# EAGLE design main (EAGLE 9.3.0)
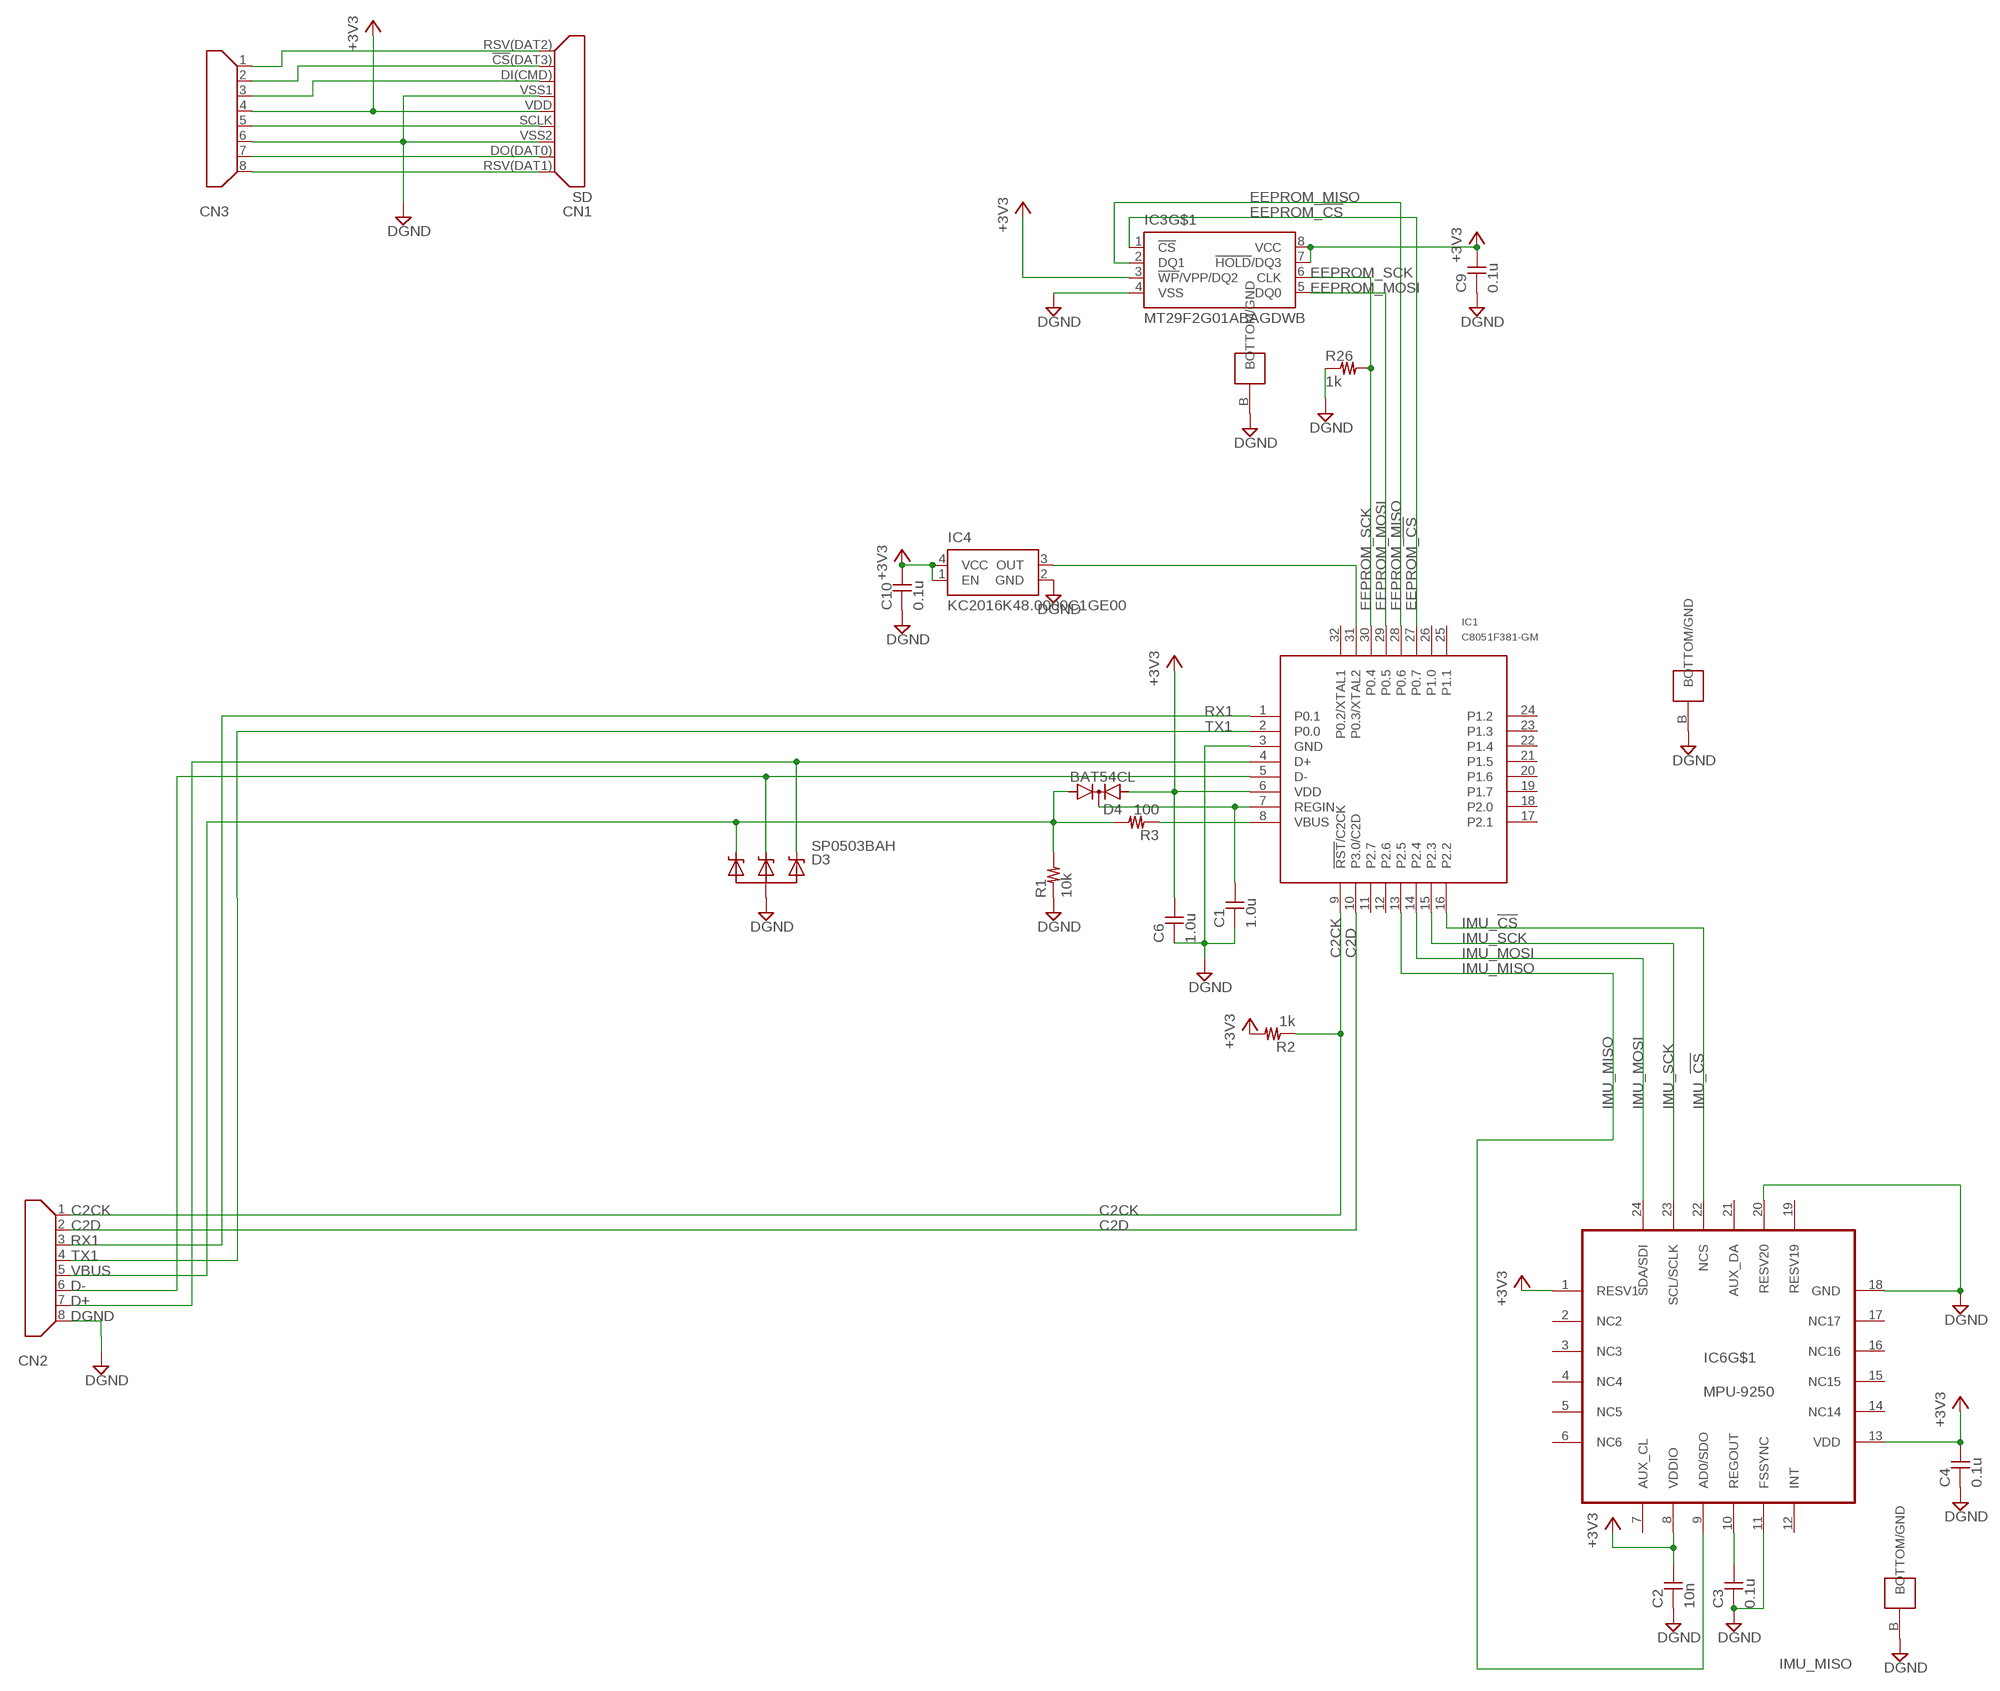
[diagram p0: schematic, sheet 1]

## Parts
C1  1.0u  C-1005  [1005]
C2  10n  C-1005  [1005]
C3  0.1u  C-1005  [1005]
C4  0.1u  C-1005  [1005]
C6  1.0u  C-1005  [1005]
C9  0.1u  C-1005  [1005]
C10  0.1u  C-1005  [1005]
CN1  SD  [SD_V3]
CN2  MICROSD  [BLOCK_SD_CONNECTOR]
CN3  MICROSD  [BLOCK_SD_CONNECTOR]
D3  SP0503BAH  [SOT143]
D4  BAT54CL  HSMS-2854  [SOT23]
IC1  C8051F381-GM  [QFN32]
IC3  MT29F2G01ABAGDWB  N25Q512A  [V-PDFN-8]
IC4  KC2016K48.0000C1GE00  KC2016K  [KC2016K]
IC6  MPU-9250  [QFN-24]
R1  10k  R-1005  [1005]
R2  1k  R-1005  [1005]
R3  100  R-1005  [1005]
R26  1k  R-1005  [1005]

## Nets
+3V3 [power]: C2.P$2 C4.P$2 C6.P$2 C9.P$2 C10.P$2 CN1.VDD CN3.4 D4.2(A2) IC1.6(VDD) IC3.3(!WP!/VPP/DQ2) IC3.7(!HOLD!/DQ3) IC3.8(VCC) IC4.1(EN) IC4.4(VCC) IC6.1(RESV1) IC6.8(VDDIO) IC6.13(VDD) R2.P$2
C2CK: CN2.1 IC1.9(!RST!/C2CK) R2.P$1
C2D: CN2.2 IC1.10(P3.0/C2D)
D+: CN2.7 D3.2 IC1.4(D+)
D-: CN2.6 D3.3 IC1.5(D-)
DGND [power]: C1.P$1 C2.P$1 C3.P$1 C4.P$1 C6.P$1 C9.P$1 C10.P$1 CN1.VSS1 CN1.VSS2 CN2.8 CN3.6 D3.1 IC1.3(GND) IC1.B(BOTTOM/GND) IC3.4(VSS) IC3.B(BOTTOM/GND) IC4.2(GND) IC6.11(FSSYNC) IC6.18(GND) IC6.20(RESV20) IC6.B(BOTTOM/GND) R1.P$1 R26.P$1
EEPROM_!CS: IC1.27(P0.7) IC3.1(!CS)
EEPROM_MISO: IC1.28(P0.6) IC3.2(DQ1)
EEPROM_MOSI: IC1.29(P0.5) IC3.5(DQ0)
EEPROM_SCK: IC1.30(P0.4) IC3.6(CLK) R26.P$2
IMU_!CS: IC1.16(P2.2) IC6.22(NCS)
IMU_MISO: IC1.13(P2.5) IC6.9(AD0/SDO)
IMU_MOSI: IC1.14(P2.4) IC6.24(SDA/SDI)
IMU_SCK: IC1.15(P2.3) IC6.23(SCL/SCLK)
N$1 [power]: C1.P$2 D4.3(C) IC1.7(REGIN)
N$2: CN1.RSV(DAT1) CN3.8
N$3: CN1.DO(DAT0) CN3.7
N$4: IC1.8(VBUS) R3.P$1
N$6: CN1.SCLK CN3.5
N$10: CN1.DI(CMD) CN3.3
N$11: IC1.31(P0.3/XTAL2) IC4.3(OUT)
N$12: CN1.!CS!(DAT3) CN3.2
N$13: C3.P$2 IC6.10(REGOUT)
N$14: CN1.RSV(DAT2) CN3.1
RX1: CN2.3 IC1.1(P0.1)
TX1: CN2.4 IC1.2(P0.0)
VBUS [power]: CN2.5 D3.4 D4.1(A1) R1.P$2 R3.P$2
Unconnected: IC1.11(P2.7) IC1.12(P2.6) IC1.17(P2.1) IC1.18(P2.0) IC1.19(P1.7) IC1.20(P1.6) IC1.21(P1.5) IC1.22(P1.4) IC1.23(P1.3) IC1.24(P1.2) IC1.25(P1.1) IC1.26(P1.0) IC1.32(P0.2/XTAL1) IC6.2(NC2) IC6.3(NC3) IC6.4(NC4) IC6.5(NC5) IC6.6(NC6) IC6.7(AUX_CL) IC6.12(INT) IC6.14(NC14) IC6.15(NC15) IC6.16(NC16) IC6.17(NC17) IC6.19(RESV19) IC6.21(AUX_DA)

## Library data of the parts
C1-C4 C6 C9 C10 = reg,cap:C-
CN1 = connector:SD
CN2 CN3 = connector:MICROSD
D3 = diode:SP0503BAH
D4 = avago:HSMS-2854: Surface Mount Microwave Schottky Detector Diodes Source: Data sheet <http://www.farnell.com/datasheets/461166.pdf>
IC1 = C8051F34x:C8051F381-GM
IC3 = EEPROM:N25Q512A
IC4 = Oscillator:KC2016K
IC6 = GYRO:MPU-9250
R1-R3 R26 = reg,cap:R-

## Net classes
0 signal: width 0.152 mm
1 power: width 0.203 mm

## Board
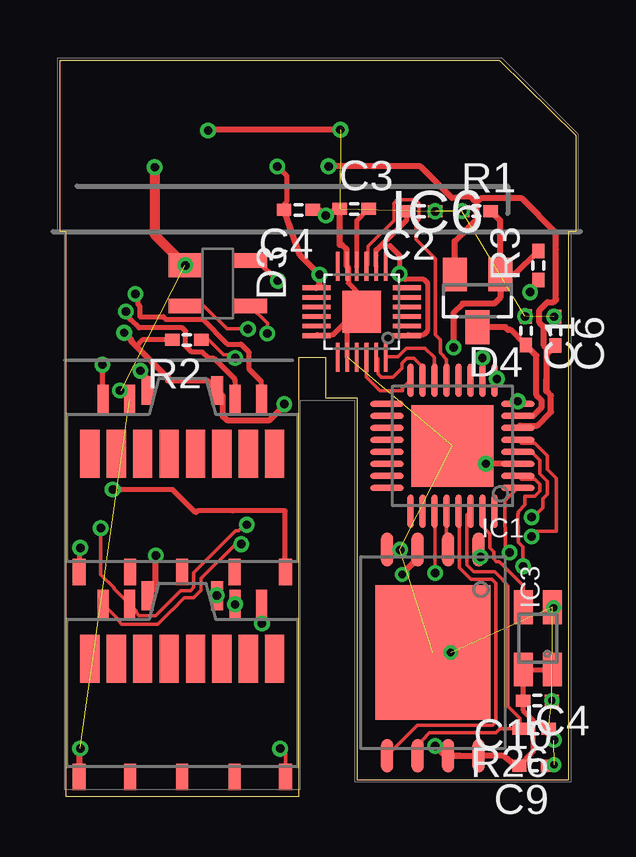
[diagram p1: board, top side]
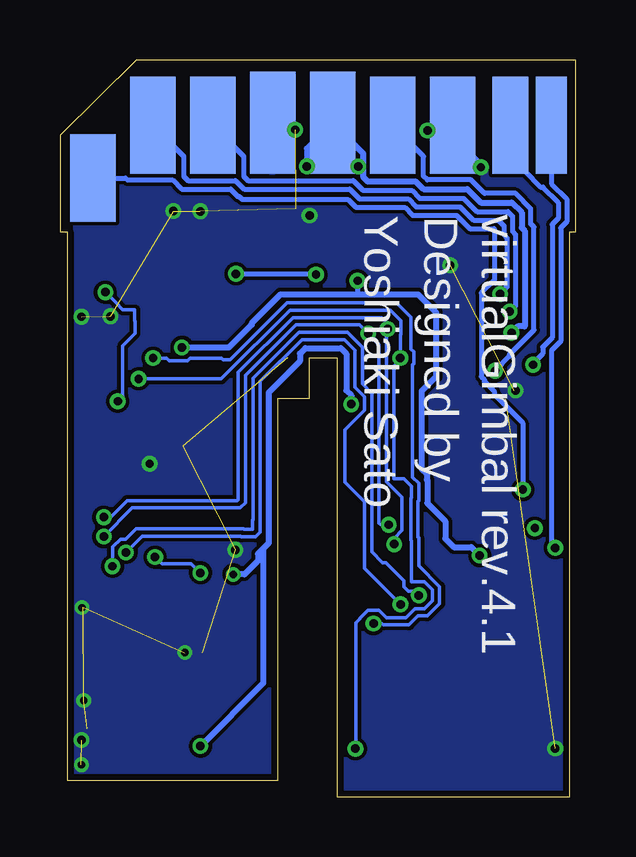
[diagram p2: board, bottom side, seen from below]

Size 21.5 x 30.7 mm. Coordinates in mm from the lower left corner, seen from the top.
Outline: 0.25,0 0.25,23.55 0,23.55 0,30.7 18.32,30.7 21.5,27.57 21.5,23.55 21.2,23.55 21.2,0.7 12.4,0.7 12.4,16.6 11.1,16.6 11.1,18.3 9.95,18.3 9.95,0 0.25,0
Copper layers (1*16): Top 0.035mm / dielectric 1.5mm / Bottom 0.035mm
Design rules "SeeedStudio_2layer_DRU_no_angle_20140221": minimum track width 6mil, minimum drill 12mil, track to track 6mil, track to pad 6mil, pad to pad 6mil, via to via 6mil, smd to smd 0mil, copper to edge 10mil, drill to drill 10mil, minimum pad ring 10mil, minimum via ring 6mil, stop-mask expansion 2mil, vias tented up to drill 100mil, thermal gap 10mil

### Footprints (pad centres in the part's own frame; a part is rotated, then mirrored left to right if it is on the bottom)
1005 = smd 0.6 x 0.5: P$1 -0.6,0; P$2 0.6,0
SD_V3 = smd 1.9 x 4.05: !CS!(DAT3) 2.5,2.2; DI(CMD) 5,2.2; SCLK 12.5,2.2; VSS2 15,2.2 | smd 1.5 x 4.05: DO(DAT0) 17.42,2.2 | smd 1.3 x 4.05: RSV(DAT1) 19.12,2.2 | smd 1.9 x 3.65: RSV(DAT2) 0,0 | smd 1.9 x 4.25: VDD 10,2.3; VSS1 7.5,2.3
BLOCK_SD_CONNECTOR = smd 0.55 x 1.1: 1 4.3,-0.43; 8 -4.3,-0.43 | smd 0.45 x 1.2: 2 3.3,6.77; 3 2.2,6.77; 6 -2.2,6.77; 7 -3.3,6.77 | smd 0.5 x 1.2: 4 1.45,7.13; 5 -1.45,7.13 | smd 0.5 x 1.1: 9 -2.18,-0.43; 10 0,-0.43; 11 2.18,-0.43 | smd 0.8 x 2: 12 -3.85,4.5; 13 -2.75,4.5; 14 -1.65,4.5; 15 -0.55,4.5; 16 0.55,4.5; 17 1.65,4.5; 18 2.75,4.5; 19 3.85,4.5
SOT143 = smd 1 x 1.4: 1 -0.75,-1.35 | smd 0.6 x 1.4: 2 0.95,-1.35; 3 0.95,1.35; 4 -0.95,1.35
SOT23 = smd 1 x 1.4: 1 -0.95,-1.1; 2 0.95,-1.1; 3 0,1.1
QFN32 = smd 1.4 x 0.25: 1 -2.725,1.75; 2 -2.725,1.25; 3 -2.725,0.75; 4 -2.725,0.25; 5 -2.725,-0.25; 6 -2.725,-0.75; 7 -2.725,-1.25; 8 -2.725,-1.75; 17 2.725,-1.75; 18 2.725,-1.25; 19 2.725,-0.75; 20 2.725,-0.25; 21 2.725,0.25; 22 2.725,0.75; 23 2.725,1.25; 24 2.725,1.75 | smd 0.25 x 1.4: 9 -1.75,-2.725; 10 -1.25,-2.725; 11 -0.75,-2.725; 12 -0.25,-2.725; 13 0.25,-2.725; 14 0.75,-2.725; 15 1.25,-2.725; 16 1.75,-2.725; 25 1.75,2.725; 26 1.25,2.725; 27 0.75,2.725; 28 0.25,2.725; 29 -0.25,2.725; 30 -0.75,2.725; 31 -1.25,2.725; 32 -1.75,2.725 | smd 3.4 x 3.4: B 0,0
V-PDFN-8 = smd 1.4 x 0.5: 1 -4.3,1.905; 2 -4.3,0.635; 3 -4.3,-0.635; 4 -4.3,-1.905; 5 4.3,-1.905; 6 4.3,-0.635; 7 4.3,0.635; 8 4.3,1.905 | smd 5.6 x 4.8: B 0,0
KC2016K = smd 1.4 x 0.8: 1 -1.3,-0.6; 2 1.3,-0.6; 3 1.3,0.6; 4 -1.3,0.6
QFN-24 = smd 1.22 x 0.2: 1 -1.89,1; 2 -1.89,0.6; 3 -1.89,0.2; 4 -1.89,-0.2; 5 -1.89,-0.6; 6 -1.89,-1; 13 1.89,-1; 14 1.89,-0.6; 15 1.89,-0.2; 16 1.89,0.2; 17 1.89,0.6; 18 1.89,1 | smd 0.2 x 1.22: 7 -1,-1.89; 8 -0.6,-1.89; 9 -0.2,-1.89; 10 0.2,-1.89; 11 0.6,-1.89; 12 1,-1.89; 19 1,1.89; 20 0.6,1.89; 21 0.2,1.89; 22 -0.2,1.89; 23 -0.6,1.89; 24 -1,1.89 | smd 1.59 x 1.75: B 0,0

### Placement (x,y rotation side)
C1  19.43,19.42 270 top
C2  15.05,24.39 180 top
C3  12.27,24.5 0 top
C4  9.94,24.46 180 top
C6  20.66,19.4 270 top
C9  19.75,1.3 180 top
C10  19.91,4.01 180 top
CN1  20.13,25.78 0 bottom
CN2  5.1,1.25 0 top
CN3  5.1,9.8 0 top
D3  6.58,21.39 270 top
D4  17.41,20.66 180 top
IC1  16.36,14.62 180 top
IC3  15.55,6 270 top
IC4  19.93,6.6 90 top
IC6  12.58,20.21 180 top
R1  17.36,24.41 0 top
R2  5.29,19.04 180 top
R3  19.95,22.14 90 top
R26  19.77,2.84 180 top

### Tracks (layer width: path | path; a pad name or v marks a point on that pad's centre or on a via)
+3V3  (via drill 0.3, 0.35)
  Top 0.203: IC3.3 14.97,10.36 | 19.72,1.87 19.72,3.2 19.31,3.61 C10.P$2 19.31,5.29 IC4.4 IC4.1 | 19.72,1.87 19.09,1.24 | C9.P$2 19.72,1.87 | IC6.8 13.18,22.8 | C4.P$2 9.34,24.69 9.46,24.8 9.46,25.86 v9.06,26.26 | IC6.1 14.52,19.26 15.17,19.26 15.33,19.42 15.33,21.4 15.17,21.56 14.39,21.56 v14.16,21.79 14.16,22.3 14.16,22.57 13.77,22.96 13.39,22.96 13.22,22.8 | 13.18,22.55 13.18,22.8 | 13.18,22.8 13.22,22.8 | 13.22,22.8 14.45,24.03 C2.P$2 | 16.35,24.95 16.49,24.95 16.52,24.99 17.13,24.99 17.26,24.86 17.37,24.74 | R2.P$2 3.44,19.04 3.18,18.78
  Top 0.254: IC3.7 16.7,1.71 | 16.7,1.71 IC3.8 18.49,1.71 19.09,1.24 | C4.P$2 10.02,22.57 v10.82,21.76 10.82,21.35 IC6.13 | v2.68,19.34 2.99,19.02 2.99,18.97 3.18,18.78 4.4,17.56 4.45,17.56 4.49,17.52 4.49,17.35 6.13,17.35 CN3.4 6.8,16.68 6.8,15.85 6.96,15.69 8.74,15.69 9.2,16.15 9.46,16.15 9.46,16.25 v9.35,16.36 | 19.32,4.01 C10.P$2 | 16.7,1.71 16.05,1.71 v15.64,2.11 | IC3.3 14.91,9.91 v14.27,9.27 | 20.29,16.89 20.48,16.71 20.48,16.04 19.9,15.47 19.18,15.47 IC1.6 | 20.29,16.89 20.28,16.91 20.28,17.39 | C6.P$2 20.29,18.43 | 20.29,16.89 20.29,18.3 | 20.29,18.3 20.29,18.43 | D4.2 16.46,23.16 17.37,24.07 17.37,24.74 | v11.2,26.27 15.03,26.27 16.35,24.95 | 17.26,24.86 17.47,24.86 17.55,24.93 19.26,24.93 20.68,23.5 20.68,22.8 20.68,20.76 20.68,20.7 20.59,20.61 20.33,20.61 20,20.28 20,19.75 20.14,19.61 20.14,19.59 20.18,19.54 20.18,18.8 20.29,18.69 20.29,18.3 | 20.29,18.3 | 20.29,18.3 20.29,18.43
  Bottom 0.203: v9.06,26.26 8.87,26.26 8.86,26.25 | v14.16,21.79 10.85,21.79 v10.82,21.76
  Bottom 0.254: v14.27,9.27 13.8,9.27 13.24,9.83 13.24,10.12 13.02,10.35 | v2.68,19.34 2.41,19.6 2.12,19.6 2.12,23.59 2.25,23.71 2.25,24.35 2.66,24.76 3.95,24.76 4.51,25.32 6.34,25.32 6.67,25.65 8.67,25.65 8.86,25.84 8.86,26.25 8.86,26.81 CN1.VDD 11.2,27.01 v11.2,26.27 | v15.64,2.11 13.02,4.74 13.02,10.35 | 13.02,10.35 12.8,10.57 12.8,16.84 11.5,18.14 11.5,18.46 11.26,18.7 9.79,18.7 9.55,18.46 9.55,16.93 9.35,16.73 v9.35,16.36
C2CK  (via drill 0.35)
  Top 0.152: IC1.9 18.15,17.35 v18.22,17.41 | v9.18,2 9.4,1.79 CN2.1 | R2.P$1 6.2,19.04 6.82,18.42 7.17,18.42 v7.31,18.28
  Bottom 0.152: v18.22,17.41 14.77,17.41 11.92,20.27 7.73,20.27 7.29,19.83 7.29,19.27 7.31,19.24 v7.31,18.28 7.31,18.22 7.58,17.95 7.58,13.26 7.17,13.26 6.84,12.93 6.84,12.47 6.87,12.44 6.87,10.69 6.84,10.67 6.84,8.95 6.3,8.95 5.98,8.63 5.98,8.17 6.3,7.84 6.69,7.84 7.07,7.46 7.89,7.46 8.19,7.77 8.65,7.77 8.98,7.44 8.98,7.42 9.15,7.25 9.15,2.03 v9.18,2
C2D  (via drill 0.35)
  Top 0.152: IC1.10 v17.61,18.28 | v8.42,7.21 8.42,8 CN2.2
  Bottom 0.152: v8.42,7.21 8.07,7.21 8.01,7.16 6.94,7.16 6.57,7.54 6.18,7.54 5.67,8.04 5.67,8.75 6.54,9.62 6.54,10.79 6.57,10.82 6.57,12.31 6.53,12.34 6.53,13.06 6.79,13.32 6.79,18 6.75,18.05 6.75,18.54 6.87,18.66 6.87,19.98 7.46,20.58 12.04,20.58 14.41,18.21 14.69,18.21 14.77,18.28 16.07,18.28 16.18,18.17 16.95,18.17 17.06,18.28 v17.61,18.28
D+  (via drill 0.35)
  Top 0.152: v19.67,11.65 19.75,11.65 20.13,12.04 20.13,12.41 20.32,12.6 20.32,13.15 20.02,13.45 20.02,14.02 19.7,14.35 19.12,14.35 IC1.4 | CN2.7 2.45,7.37 2.45,7.33 2.58,7.19 4.07,7.19 4.67,7.8 4.7,7.8 5.19,8.29 5.57,8.29 5.88,8.6 5.88,9.1 7.31,10.53 v7.56,10.53 | v7.84,19.5 6.97,19.5 6.02,20.45 D3.2
  Bottom 0.152: v19.67,11.65 19.39,11.65 18.7,12.34 14.11,12.34 14.07,12.38 14.07,17.69 11.79,19.97 8.09,19.97 7.87,19.75 7.88,19.73 7.88,19.3 | v7.56,10.53 7.56,10.78 7.24,11.1 7.24,12.49 7.88,13.13 7.88,19.3 | 7.88,19.3 | 7.88,19.3 7.84,19.34 v7.84,19.5
D-  (via drill 0.35)
  Top 0.152: IC1.5 19.24,14.73 19.81,14.73 20.32,14.22 20.32,13.64 20.7,13.27 20.7,11.07 20.2,11.07 19.89,11.07 v19.67,10.85 | v7.79,11.33 7.7,11.33 7.45,11.08 7.33,11.08 7.12,10.88 5.58,9.33 5.58,8.73 5.45,8.59 5.04,8.59 4,7.55 3.31,7.55 3.17,7.68 3.17,7.75 CN2.6 2.25,8.67 2.25,8.71 1.71,9.26 1.71,10.73 1.7,10.74 v1.7,11.19 | D3.3 8.65,19.72 v8.65,19.3
  Bottom 0.152: v19.67,10.85 18.48,12.04 13.98,12.04 13.76,12.25 13.76,17.56 11.66,19.66 9.01,19.66 v8.65,19.3 8.19,18.84 8.19,18.3 | 8.19,18.3 8.19,17.8 8.19,11.4 8.12,11.33 v7.79,11.33 | 8.19,18.3
DGND  (via drill 0.3, 0.35)  (14 unrouted)
  Top 0.203: IC6.20 11.98,19.61 12.43,20.07 | 12.43,20.07 IC6.B 12.58,20.85 12.02,21.4 12.02,22.06 IC6.11 | IC6.18 10.74,19.26 11.39,19.26 12.2,20.07 12.43,20.07 | C4.P$1 10.85,24.46 v11.09,24.22 11.17,24.22 11.45,24.5 C3.P$1 | C1.P$1 v19.39,20.02
  Top 0.254: C3.P$1 11.67,22.99 11.78,22.99 11.96,22.81 11.96,22.12 IC6.11 | IC1.3 v17.76,13.88 17.01,14.62 | v0.85,2.02 0.8,1.97 CN2.8 | CN3.6 2.55,16.93 v2.51,16.93 | v11.69,27.8 6.21,27.8 v6.17,27.76 | 20.56,1.29 C9.P$1 20.57,1.3 v20.61,1.33 | R26.P$1 20.37,2.59 v20.6,2.36 | IC3.4 14.17,10.31 v14.18,10.29 | IC3.B v16.29,6.01 | C6.P$1 v20.6,20 | IC4.2 20.56,7.9 v20.58,7.88
  Top 0.305: IC1.B 17.01,14.62
  Top 0.406: v3.95,26.23 3.95,23.42 D3.1
  Bottom 0.254: CN1.VSS2 5.24,28.09 5.57,27.76 v6.17,27.76 | CN1.VSS1 12.34,27.8 v11.69,27.8
  Bottom 0.406: CN1.VSS2 5.13,27.41 v3.95,26.23
  other vias: 20.51,4.01 15.65,24.39 16.77,24.41 5.23,22.14
  pour Bottom: -0.3,-0.7 22.7,-0.7 22.7,26.3 -0.3,26.3
EEPROM_!CS  (via drill 0.35)
  Top 0.152: v17.54,9.99 17.54,10.23 IC3.1 | IC1.27 15.61,11.57 15.64,11.54 v15.64,9.33
  Bottom 0.152: v15.64,9.33 16.02,9.71 17.25,9.71 v17.54,9.99
EEPROM_MISO
  Top 0.152: IC1.28 16.11,10.38 IC3.2
EEPROM_MOSI
  Top 0.152: IC3.5 14.92,2.98 18.04,2.98 18.18,3.11 18.18,8.9 18.01,9.07 17.13,9.07 16.66,9.54 16.66,11.9 IC1.29
EEPROM_SCK
  Top 0.152: 18.68,8.57 18.68,3.77 19.17,3.28 R26.P$2 18.34,2.84 18.17,2.67 15.88,2.67 15.41,2.67 15.09,2.34 15.09,1.88 IC3.6 | 18.68,8.57 18.68,8.8 | 18.68,8.57 18.68,8.8 | 18.68,8.8 18.48,9 18.48,9.03 18.13,9.38 17.26,9.38 16.97,9.67 16.97,11.75 IC1.30
IMU_!CS
  Top 0.152: IC6.22 12.78,17.48 13.35,16.91 14.2,16.91 | 14.2,16.91 14.29,16.91 14.29,17.02 IC1.16 | 14.2,16.91
IMU_MISO
  Top 0.152: IC6.9 12.85,22.17 12.85,22.94 13.92,24.01 13.92,24.74 14.05,24.87 14.84,24.87 14.98,24.74 14.98,24.05 14.84,23.92 14.84,23.24 15.66,22.42 15.66,19.25 15.87,19.05 15.87,18.96 15.86,18.96 15.86,18.5 16.11,18.24 IC1.13
IMU_MOSI
  Top 0.152: IC1.14 15.61,18.31 15.23,18.7 14.45,18.7 14.09,18.34 13.6,18.34 IC6.24
IMU_SCK
  Top 0.152: IC1.15 15.11,17.93 14.76,18.28 14.69,18.28 14.47,18.28 14.26,18.07 14.26,17.86 13.88,17.48 13.7,17.48 13.4,17.48 13.25,17.63 13.25,18.25 IC6.23
N$1
  Top 0.203: IC1.7
  Top 0.254: 20.07,16.21 20.07,16.54 19.87,16.74 19.87,18.38 C1.P$2 18.8,19.46 18.68,19.46 18.57,19.57 D4.3 | 20.07,16.21 | 20.07,16.21 19.73,15.87 IC1.7
N$2  (via drill 0.35)
  Top 0.203: v0.85,10.38 0.8,10.33 CN3.8
  Bottom 0.203: v0.85,10.38 1.01,10.54 1.01,18.59 0.62,18.98 0.62,23.7 0.37,23.95 0.37,24.91 1.01,25.55 CN1.RSV(DAT1)
N$3  (via drill 0.35)
  Top 0.203: v1.76,18 1.76,16.61 CN3.7
  Bottom 0.203: CN1.DO(DAT0) 2.71,26.1 2.67,26.06 2.12,26.06 1.47,25.4 1.36,25.4 0.73,24.77 0.73,24.1 0.98,23.85 0.98,19.13 1.37,18.73 1.37,18.46 1.76,18.07 v1.76,18
N$4  (via drill 0.35)
  Top 0.152: v19.09,16.48 IC1.8 | R3.P$1 19.61,21.21 v19.61,21.03
  Bottom 0.152: v19.09,16.48 18.88,16.69 18.88,18.8 18.37,19.31 18.37,19.82 18.38,19.83 18.38,20.29 18.88,20.29 19.16,20.58 v19.61,21.03
N$6  (via drill 0.35)
  Top 0.2: v3.35,17.75 3.69,17.41 3.69,16.96
  Top 0.254: 3.69,16.96 CN3.5
  Bottom 0.203: CN1.SCLK 6.33,26.68 6.33,25.85 6.19,25.7 4.36,25.7 3.8,25.14 2.5,25.14 1.87,24.51 1.87,23.87 1.74,23.74 1.74,19.44 2.75,18.43 2.75,18.35 v3.35,17.75
N$10  (via drill 0.35)
  Top 0.2: 7.29,17.39 6.42,18.27 6.2,18.27 5.94,18.53 5.49,18.53 5.25,18.78 5.25,19.39 5.1,19.54 3.29,19.54 2.95,19.88
  Top 0.203: CN3.3 7.3,17.3 7.29,17.3 7.29,17.39 | v2.75,20.21 2.84,20.12 2.84,19.99 2.95,19.88
  Bottom 0.203: CN1.DI(CMD) 13.83,26.68 13.83,25.85 13.66,25.68 9.27,25.68 8.86,25.27 6.83,25.27 6.5,24.94 4.67,24.94 4.11,24.38 2.82,24.38 2.63,24.2 2.63,23.56 2.5,23.43 2.5,20.46 v2.75,20.21
N$11
  Top 0.152: IC4.3 19.32,8.8 18.32,9.8 18.2,9.8 18.09,9.91 18.09,10.22 17.93,10.38 17.93,10.95 17.61,11.27 IC1.31
N$12  (via drill 0.35)
  Top 0.2: 3.33,20.01 4.3,20.01 4.42,19.89 5.94,19.89
  Top 0.203: CN3.2 8.4,17.3 7.89,17.81 7.89,18.52 7.55,18.86 6.97,18.86 5.94,19.89 | v3.15,20.95 3.25,20.85 3.25,20.53 3.33,20.46 3.33,20.01
  Bottom 0.203: CN1.!CS!(DAT3) 16.33,26.68 16.33,25.85 16.16,25.68 14.18,25.68 13.82,25.32 9.41,25.32 9.01,24.91 6.98,24.91 6.65,24.58 4.82,24.58 4.26,24.03 3.22,24.03 2.99,23.79 2.99,23.41 2.86,23.28 2.86,21.25 v3.15,20.95
N$13
  Top 0.203: IC6.10 12.38,24 C3.P$2
N$14  (via drill 0.35)
  Top 0.2: 7.2,11.92 5.73,11.92 5.66,11.84 4.7,12.8 v2.2,12.8
  Top 0.203: CN3.1 9.4,11.92 7.2,11.92
  Bottom 0.2: 3.93,20.99 3.93,17.51 3.81,17.39 3.81,17.3 3.39,16.88 3.39,16.77
  Bottom 0.203: CN1.RSV(DAT2) 18.76,25.78 18.68,25.7 16.8,25.7 16.42,25.32 14.38,25.32 14.07,25.01 14.01,25.01 13.9,24.89 9.49,24.89 9.15,24.55 7.12,24.55 6.79,24.23 4.97,24.23 4.41,23.67 3.39,23.67 3.39,21.53 3.93,20.99 | v2.2,12.8 2.2,15.58 3.39,16.77
RX1  (via drill 0.35)
  Top 0.152: IC1.1 18.55,12.34 18.55,12.3 18.55,11.24 18.56,11.23 18.56,10.88 18.56,10.37 v18.75,10.19
  Bottom 0.152: CN2.3 8.8,9.52 8.8,12.3 9.6,13.11 9.6,15.3 8.8,16.11 8.8,16.67 9.2,17.07 9.2,18.61 9.64,19.05 11.41,19.05 13.15,17.31 13.15,11.02 13.33,10.84 13.94,10.84 13.97,10.87 18.06,10.87 v18.75,10.19
  other vias: 7.3,8.02
TX1  (via drill 0.35)
  Top 0.152: IC1.2 19.24,13.23 19.81,13.23 20.02,13.02 20.02,12.73 19.81,12.52 19.39,12.52 19.39,12.16 19.11,11.88 19.11,11.82 19.09,11.8 | 19.09,11.8 19.09,11.49 | v19.31,9.61 v19.3,9.61 19.3,10.42 19.11,10.61 19.11,11.3 19.09,11.32 19.09,11.8
  Top 0.2: CN2.4 v6.53,8.4
  Bottom 0.152: v19.31,9.61 v19.3,9.61 19.3,10.42 18.97,10.74 18.76,10.74 18.33,11.17 13.85,11.17 13.82,11.14 13.46,11.14 13.46,11.55 13.46,17.44 11.54,19.36 9.51,19.36 | 8.89,18.74 9.51,19.36 | 8.89,18.74 9.51,19.36 | 8.89,18.74 8.89,17.2 8.49,16.8 8.49,10.21 8.04,9.76 7.9,9.76 7.15,9.01 7.15,8.75 6.97,8.57 6.71,8.57 v6.53,8.4
VBUS  (via drill 0.35)
  Top 0.203: D3.4 8.24,22.35 v9.09,21.5
  Top 0.254: CN2.5 4,8.73 v4,10.05 | D4.1 18.36,20.8 18.1,20.54 16.79,20.54 16.41,20.16 v16.41,18.73 | D4.1 18.36,24.01 R1.P$2 | R3.P$2 18.97,21.77 D4.1
  Bottom 0.203: v9.09,21.5 9.09,21 9.16,20.94
  Bottom 0.254: v4,10.05 4.35,10.4 5.08,10.4 5.43,10.76 5.43,11.49 6.18,12.23 6.18,13.2 6.2,13.23 6.2,13.43 6.42,13.65 6.42,16.91 5.82,17.5 5.82,20.19 6.57,20.94 9.16,20.94 12.3,20.94 13.51,19.73 13.51,19.66 14.45,18.73 v16.41,18.73

### Text on the board
bNames: virtualGimbal rev.4.1 | Designed by | Yoshiaki Sato